# EAGLE design sb3 (EAGLE 9.4.0)
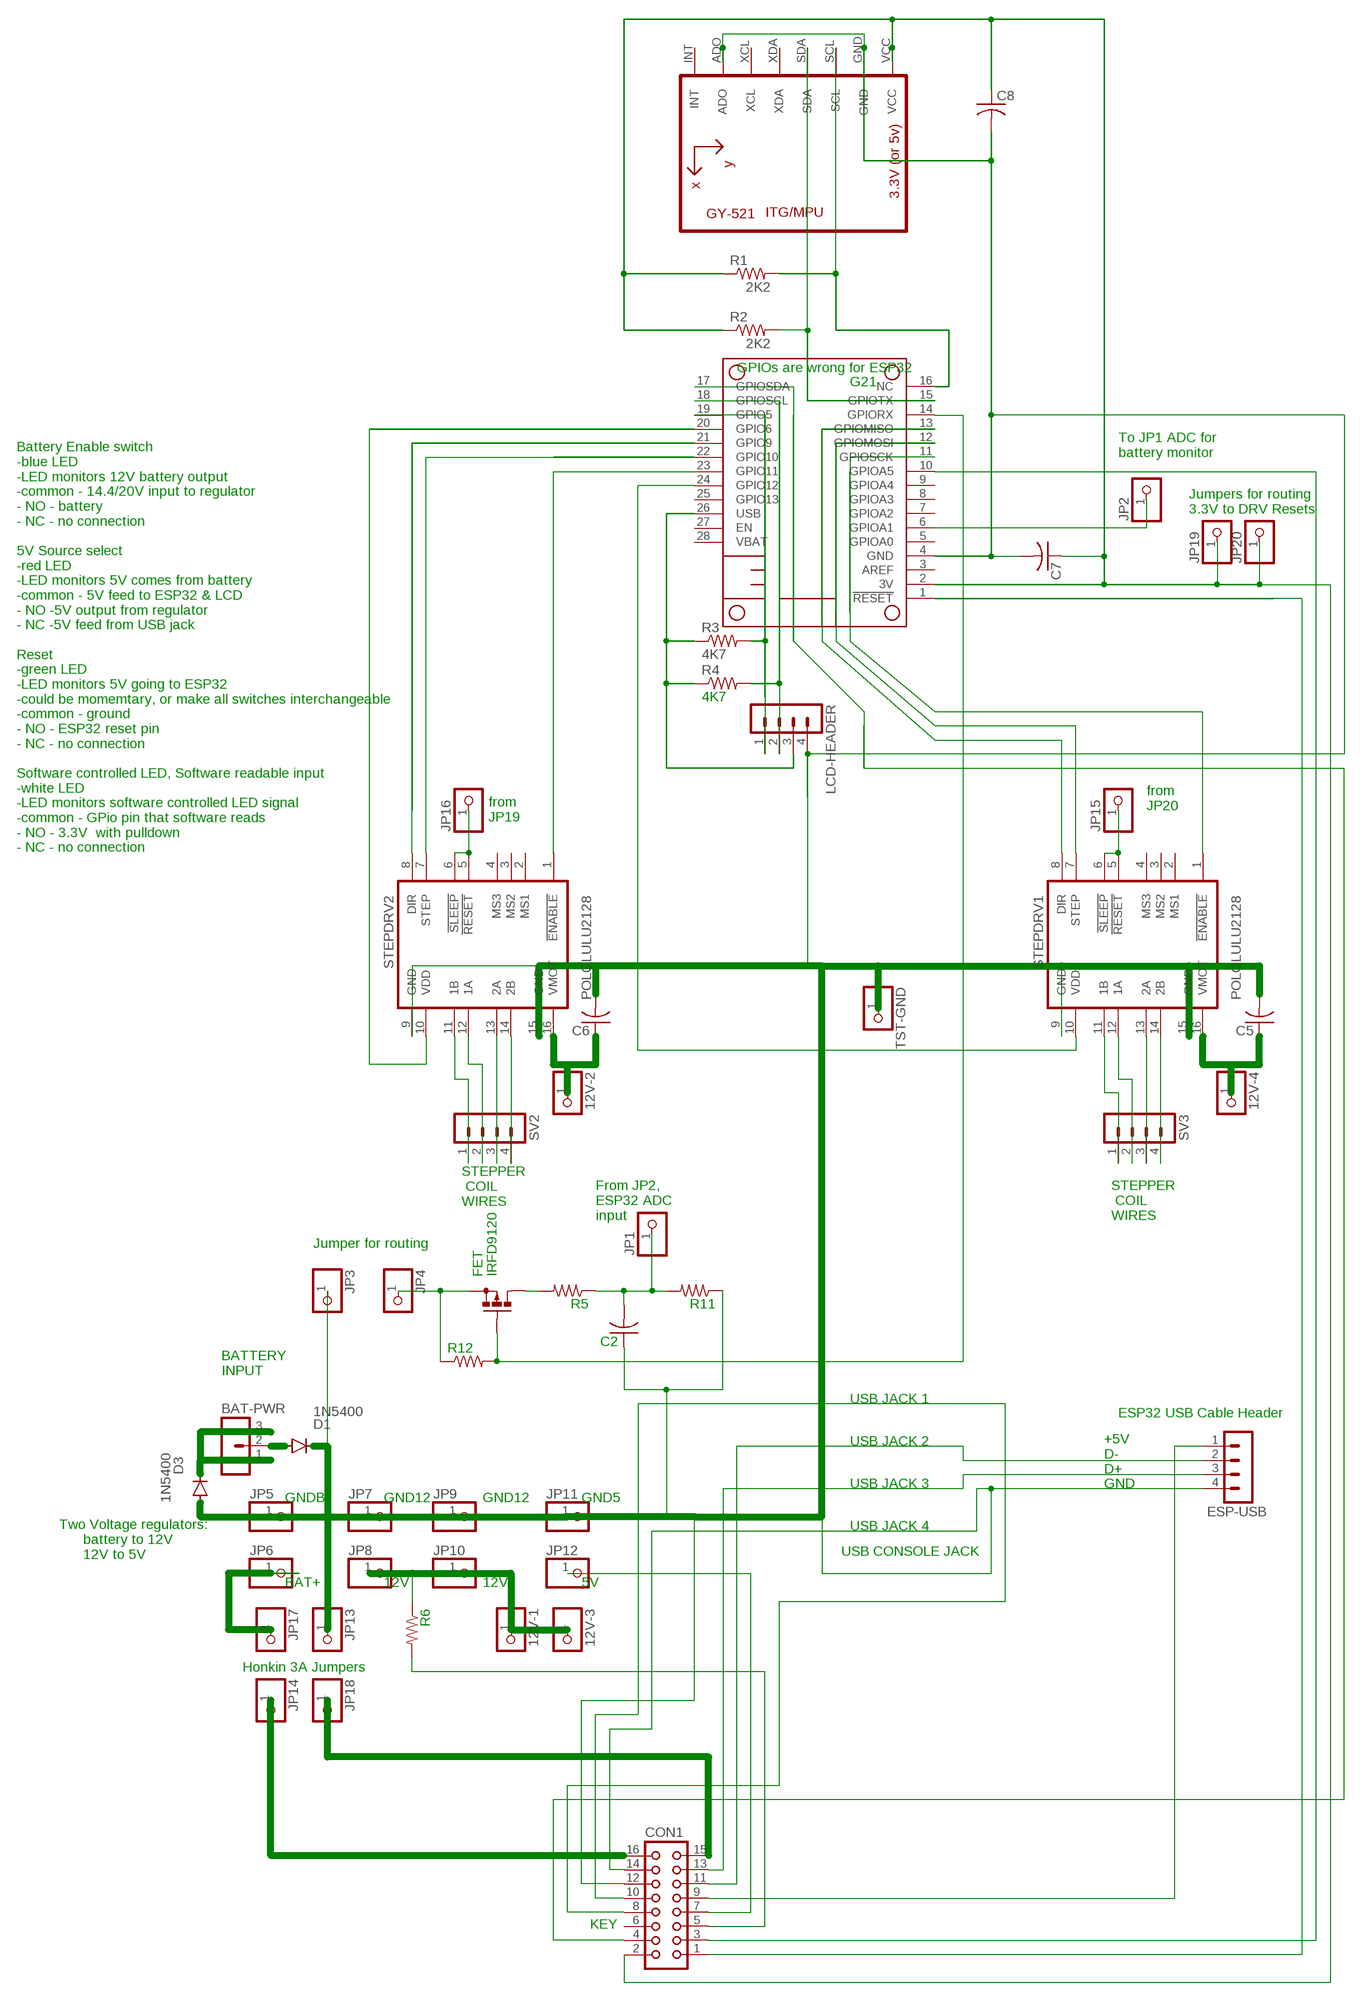
[diagram p0: schematic, sheet 1]

## Parts
12V-1  PINHD-1X1  [1X01]
12V-2  PINHD-1X1  [1X01]
12V-3  PINHD-1X1  [1X01]
12V-4  PINHD-1X1  [1X01]
BAT-PWR  MA03-1  [MA03-1]
C2  C-US050-025X075  [C050-025X075]
C5  C-US050-024X044  [C050-024X044]
C6  C-US050-024X044  [C050-024X044]
C7  C-US050-024X044  [C050-024X044]
C8  C-US050-024X044  [C050-024X044]
CON1  CON16  [CON16]
D1  1N5400  [DO201-15]
D3  1N5400  [DO201-15]
ESP-USB  MA04-1  [MA04-1]
FET  IRFD9120  [C370-01]
JP1  PINHD-1X1  [1X01]
JP2  PINHD-1X1  [1X01]
JP3  PINHD-1X1  [1X01]
JP4  PINHD-1X1  [1X01]
JP5  PINHD-1X1  [1X01]
JP6  PINHD-1X1  [1X01]
JP7  PINHD-1X1  [1X01]
JP8  PINHD-1X1  [1X01]
JP9  PINHD-1X1  [1X01]
JP10  PINHD-1X1  [1X01]
JP11  PINHD-1X1  [1X01]
JP12  PINHD-1X1  [1X01]
JP13  PINHD-1X1  [1X01]
JP14  PINHD-1X1  [1X01]
JP15  PINHD-1X1  [1X01]
JP16  PINHD-1X1  [1X01]
JP17  PINHD-1X1  [1X01]
JP18  PINHD-1X1  [1X01]
JP19  PINHD-1X1  [1X01]
JP20  PINHD-1X1  [1X01]
LCD-HEADER  MA04-1  [MA04-1]
MS2  FEATHERWING_NOHOLES  [FEATHERWING_NOHOLES]
R1  2K2  R-US_0309/12  [0309/12]
R2  2K2  R-US_0309/12  [0309/12]
R3  4K7  R-US_0309/12  [0309/12]
R4  4K7  R-US_0309/12  [0309/12]
R5  R-US_0207/10  [0207/10]
R6  R-US_0207/10  [0207/10]
R11  R-US_0207/10  [0207/10]
R12  R-US_0207/10  [0207/10]
STEPDRV1  POLOLULU2128  [POLOLULU2128]
STEPDRV2  POLOLULU2128  [POLOLULU2128]
SV2  MA04-1  [MA04-1]
SV3  MA04-1  [MA04-1]
TST-GND  PINHD-1X1  [1X01]
U1  GY-521MPU6050  [GY-521]

## Nets
3V: C7.1 C8.1 CON1.2 JP19.1 JP20.1 MS2.2(3V) R1.1 R2.1 U1.VCC
N$1: MS2.24(GPIO12) STEPDRV1.10(VDD)
N$2: CON1.5 R6.2
N$3: MS2.13(GPIOMISO) STEPDRV1.8(DIR)
N$4: CON1.1 MS2.1(!RESET)
N$5: JP15.1 STEPDRV1.5(!RESET) STEPDRV1.6(!SLEEP)
N$6: FET.G MS2.14(GPIORX) R12.2
N$7: JP16.1 STEPDRV2.5(!RESET) STEPDRV2.6(!SLEEP)
N$8: STEPDRV2.14(2B) SV2.4
N$9: CON1.16 JP14.1
N$11: LCD-HEADER.1 MS2.19(GPIO5) R3.2
N$12: STEPDRV2.13(2A) SV2.3
N$13: STEPDRV2.12(1A) SV2.2
N$14: STEPDRV2.11(1B) SV2.1
N$15: MS2.12(GPIOMOSI) STEPDRV1.7(STEP)
N$16: STEPDRV1.14(2B) SV3.4
N$17: MS2.16(NC) R1.2 U1.SCL
N$18: STEPDRV1.13(2A) SV3.3
N$19: STEPDRV1.12(1A) SV3.2
N$20: STEPDRV1.11(1B) SV3.1
N$21: MS2.11(GPIOSCK) STEPDRV1.1(!ENABLE)
N$22: CON1.11 ESP-USB.2
N$23: CON1.13 ESP-USB.3
N$24: FET.S JP4.1 R12.1
N$25: MS2.15(GPIOTX) R2.2 U1.SDA
N$26: BAT-PWR.2 D1.A
N$27: JP6.1 JP17.1
N$28: CON1.4 MS2.17(GPIOSDA)
N$29: MS2.21(GPIO9) STEPDRV2.8(DIR)
N$30: C2.2 JP1.1 R5.1 R11.2
N$31: CON1.3 MS2.10(GPIOA5)
N$32: D1.C JP3.1 JP13.1
N$33: JP2.1 MS2.6(GPIOA1)
N$34: MS2.22(GPIO10) STEPDRV2.7(STEP)
N$35: LCD-HEADER.2 MS2.18(GPIOSCL) R4.2
N$36: MS2.20(GPIO6) STEPDRV2.10(VDD)
N$37: MS2.23(GPIO11) STEPDRV2.1(!ENABLE)
N$38: CON1.15 JP18.1
N$39: C2.1 C5.2 C6.2 C7.2 C8.2 CON1.12 CON1.14 D3.A ESP-USB.4 JP5.1 JP7.1 JP9.1 JP11.1 LCD-HEADER.4 MS2.4(GND) R11.1 STEPDRV1.9(GND) STEPDRV1.15(GND) STEPDRV2.9(GND) STEPDRV2.15(GND) TST-GND.1 U1.ADO U1.GND
N$40: CON1.8 CON1.10
N$42: 12V-1.1 12V-3.1 JP8.1 JP10.1 R6.1
N$43: CON1.7 JP12.1
N$44: 12V-2.1 C6.1 STEPDRV2.16(VMOT)
N$45: 12V-4.1 C5.1 STEPDRV1.16(VMOT)
N$46: BAT-PWR.1 BAT-PWR.3 D3.C
N$51: FET.D FET.D1(D) R5.2
N$55: CON1.9 ESP-USB.1
USB: LCD-HEADER.3 MS2.26(USB) R3.1 R4.1
Unconnected: CON1.6 MS2.3(AREF) MS2.5(GPIOA0) MS2.7(GPIOA2) MS2.8(GPIOA3) MS2.9(GPIOA4) MS2.25(GPIO13) MS2.27(EN) MS2.28(VBAT) STEPDRV1.2(MS1) STEPDRV1.3(MS2) STEPDRV1.4(MS3) STEPDRV2.2(MS1) STEPDRV2.3(MS2) STEPDRV2.4(MS3) U1.INT U1.XCL U1.XDA

## Notes on the sheet
- GPIOs are wrong for ESP32
- G21
- To JP1 ADC for
  battery monitor
- Jumpers for routing
  3.3V to DRV Resets
- from
  JP20
- from
  JP19
- Battery Enable switch
  -blue LED
  -LED monitors 12V battery output
  -common - 14.4/20V input to regulator
  - NO - battery
  - NC - no connection
  
  5V Source select
  -red LED
  -LED monitors 5V comes from battery
  -common - 5V feed to ESP32 & LCD
  - NO -5V output from regulator
  - NC -5V feed from USB jack
  
  Reset
  -green LED
  -LED monitors 5V going to ESP32
  -could be momemtary, or make all switches interchangeable
  -common - ground
  - NO - ESP32 reset pin
  - NC - no connection
  
  Software controlled LED, Software readable input
  -white LED
  -LED monitors software controlled LED signal 
  -common - GPio pin that software reads
  - NO - 3.3V  with pulldown
  - NC - no connection
- STEPPER
   COIL
  WIRES
- From JP2,
  ESP32 ADC
  input
- STEPPER
   COIL
  WIRES
- Jumper for routing
- BATTERY
  INPUT
- USB JACK 1
- ESP32 USB Cable Header
- USB JACK 2
- USB JACK 3
- +5V
  D-
  D+
  GND
- GNDB | GND12 | GND12 | GND5
- USB JACK 4
- USB CONSOLE JACK
- Two Voltage regulators:
        battery to 12V
        12V to 5V
- BAT+ | 12V | 12V | 5V
- Honkin 3A Jumpers
- KEY

## Library data of the parts
12V-1-12V-4 JP1-JP20 TST-GND = pinhead:PINHD-1X1: PIN HEADER
BAT-PWR = con-lstb:MA03-1: PIN HEADER; OC_FARNELL: unknown; OC_NEWARK: unknown
C2 C5-C8 = rcl:C-US: CAPACITOR, American symbol; SPICEPREFIX: C
CON1 = con-harting:CON16: CONNECTOR; OC_FARNELL: unknown; OC_NEWARK: unknown
D1 D3 = diode:1N5400: DIODE standard rectifier, 3 A, 50 V (Motorola)
ESP-USB LCD-HEADER SV2 SV3 = con-lstb:MA04-1: PIN HEADER; OC_FARNELL: unknown; OC_NEWARK: unknown
FET = transistor-small-signal:IRFD9120: P-CHANNEL MOS FET
MS2 = microbuilder:FEATHERWING
R1-R4 = resistor:R-US_: RESISTOR, American symbol
R5 R6 R11 R12 = rcl:R-US_: RESISTOR, American symbol; SPICEPREFIX: R
STEPDRV1 STEPDRV2 = stepper_drivers_etc:POLOLULU2128
U1 = gy-521a:GY-521

## Board
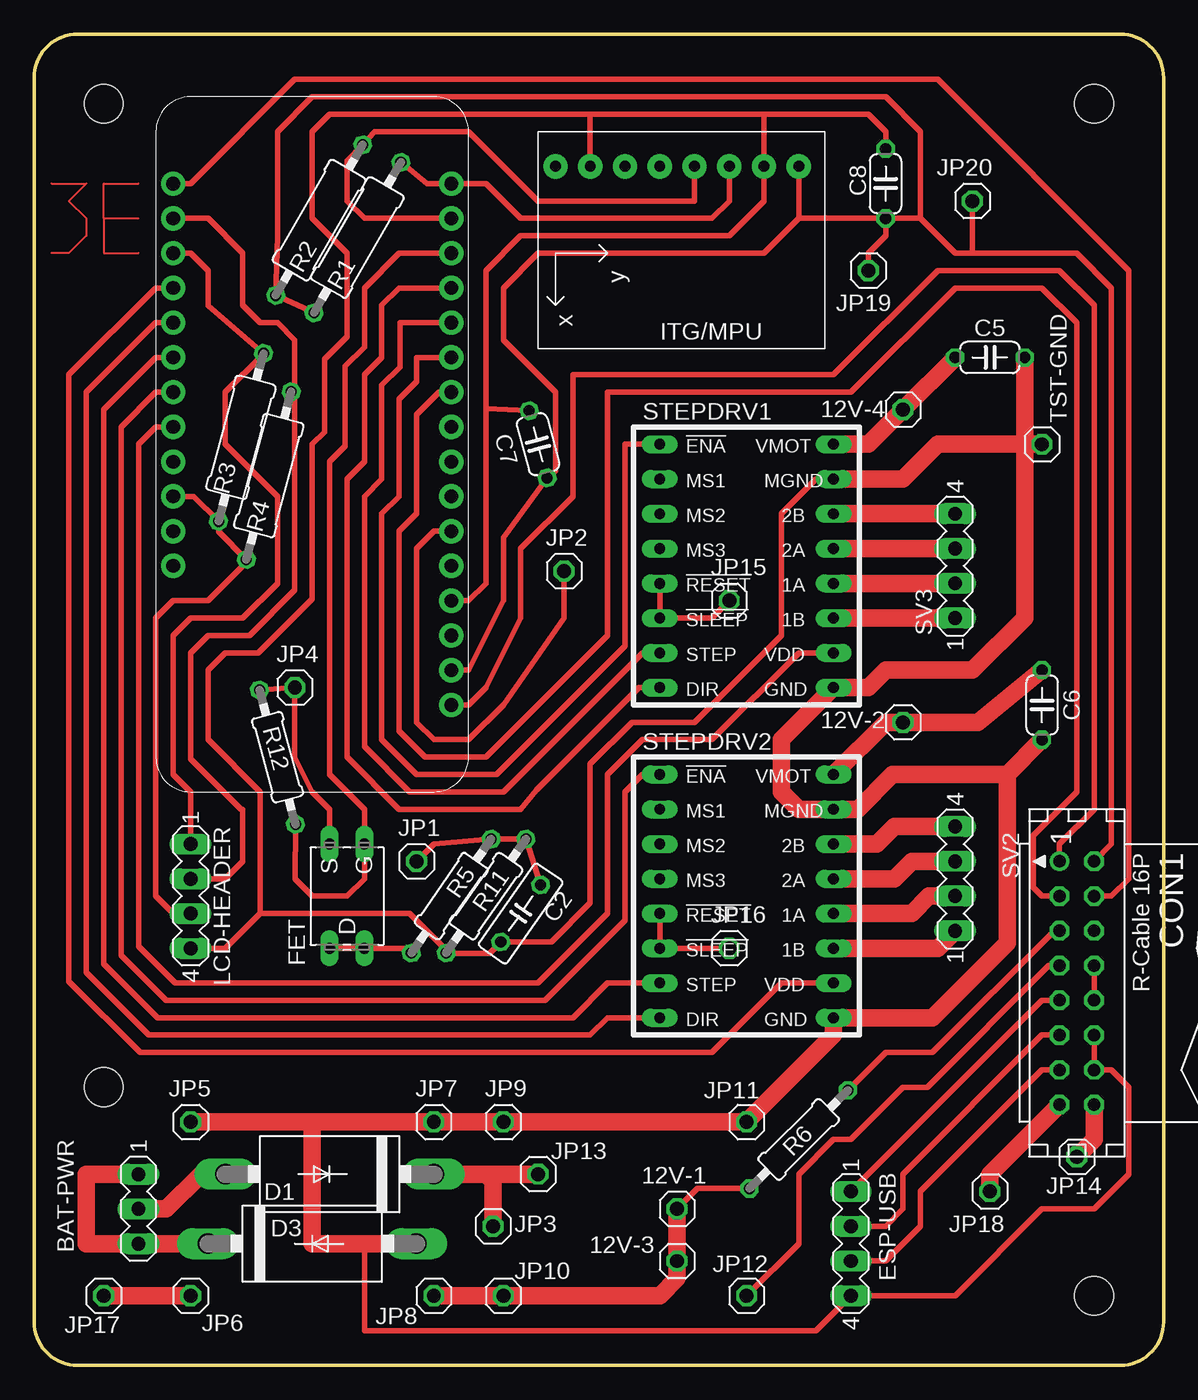
[diagram p1: board, top side]

Size 82.55 x 97.28 mm. Coordinates in mm from the lower left corner, seen from the top.
Outline: 82.55,94.11 arc90 79.38,97.28 3.17,97.28 arc90 0,94.11 0,3.17 arc90 3.17,0 79.38,0 arc90 82.55,3.17 82.55,94.11
Copper layers (1*16): Top 0.035mm / dielectric 1.5mm / Bottom 0.035mm
Design rules "default": minimum track width 6mil, minimum drill 0.35mm, track to track 6mil, track to pad 6mil, pad to pad 6mil, via to via 6mil, smd to smd 6mil, copper to edge 40mil, drill to drill 6mil, minimum pad ring 10mil, minimum via ring 8mil, stop-mask expansion 4mil, vias tented up to drill 0mil, thermal gap 10mil
Holes 2.85 mm at 77.47,92.2 5.08,20.32 5.08,92.2 77.47,5.08

### Footprints (pad centres in the part's own frame; a part is rotated, then mirrored left to right if it is on the bottom)
1X01 = drill 1.016 octagon: 1 0,0
MA03-1 = drill 1.016 long: 1 -2.54,0; 2 0,0; 3 2.54,0
C050-025X075 = drill 0.813 octagon: 1 -2.54,0; 2 2.54,0
C050-024X044 = drill 0.813 octagon: 1 -2.54,0; 2 2.54,0
CON16 = drill 0.914: 1 -8.89,-1.27 | drill 0.914 octagon: 2 -8.89,1.27; 3 -6.35,-1.27; 4 -6.35,1.27; 5 -3.81,-1.27; 6 -3.81,1.27; 7 -1.27,-1.27; 8 -1.27,1.27; 9 1.27,-1.27; 10 1.27,1.27; 11 3.81,-1.27; 12 3.81,1.27; 13 6.35,-1.27; 14 6.35,1.27; 15 8.89,-1.27; 16 8.89,1.27
DO201-15 = drill 1.499 long: A 7.62,0; C -7.62,0
MA04-1 = drill 1.016 long: 1 -3.81,0; 2 -1.27,0; 3 1.27,0; 4 3.81,0
C370-01 = drill 0.813 long: D -3.81,1.27; D1 -3.81,-1.27; G 3.81,-1.27; S 3.81,1.27
FEATHERWING_NOHOLES = drill 1 pad 1.778: 1 6.35,1.27; 2 8.89,1.27; 3 11.43,1.27; 4 13.97,1.27; 5 16.51,1.27; 6 19.05,1.27; 7 21.59,1.27; 8 24.13,1.27; 9 26.67,1.27; 10 29.21,1.27; 11 31.75,1.27; 12 34.29,1.27; 13 36.83,1.27; 14 39.37,1.27; 15 41.91,1.27; 16 44.45,1.27; 17 44.45,21.59; 18 41.91,21.59; 19 39.37,21.59; 20 36.83,21.59; 21 34.29,21.59; 22 31.75,21.59; 23 29.21,21.59; 24 26.67,21.59; 25 24.13,21.59; 26 21.59,21.59; 27 19.05,21.59; 28 16.51,21.59
0309/12 = drill 0.813 octagon: 1 -6.35,0; 2 6.35,0
0207/10 = drill 0.813 octagon: 1 -5.08,0; 2 5.08,0
POLOLULU2128 = drill 0.8 long: 1 -7.62,7.62; 2 -7.62,5.08; 3 -7.62,2.54; 4 -7.62,0; 5 -7.62,-2.54; 6 -7.62,-5.08; 7 -7.62,-7.62; 8 -7.62,-10.16; 9 5.08,-10.16; 10 5.08,-7.62; 11 5.08,-5.08; 12 5.08,-2.54; 13 5.08,0; 14 5.08,2.54; 15 5.08,5.08; 16 5.08,7.62
GY-521 = drill 0.8 pad 1.778: ADO -8.89,-6.35; GND -8.89,6.35; INT -8.89,-8.89; SCL -8.89,3.81; SDA -8.89,1.27; VCC -8.89,8.89; XCL -8.89,-3.81; XDA -8.89,-1.27

### Placement (x,y rotation side)
12V-1  46.99,11.43 0 top
12V-2  63.5,46.99 0 top
12V-3  46.99,7.62 0 top
12V-4  63.5,69.85 0 top
BAT-PWR  7.62,11.43 270 top
C2  35.56,33.02 55 top
C5  69.85,73.66 0 top
C6  73.66,48.26 270 top
C7  36.83,67.31 105 top
C8  62.23,86.36 90 top
CON1  76.2,27.94 270 top
D1  21.59,13.97 180 top
D3  20.32,8.89 0 top
ESP-USB  59.69,8.89 270 top
FET  22.86,34.29 90 top
JP1  27.94,36.83 0 top
JP2  38.73,58.04 0 top
JP3  33.53,10.16 0 top
JP4  19.05,49.53 0 top
JP5  11.43,17.78 0 top
JP6  11.43,5.08 0 top
JP7  29.21,17.78 0 top
JP8  29.21,5.08 0 top
JP9  34.29,17.78 0 top
JP10  34.29,5.08 0 top
JP11  52.07,17.78 0 top
JP12  52.07,5.08 0 top
JP13  36.83,13.97 0 top
JP14  76.2,15.24 0 top
JP15  50.8,55.88 0 top
JP16  50.8,30.48 0 top
JP17  5.08,5.08 0 top
JP18  69.85,12.7 0 top
JP19  60.96,80.01 0 top
JP20  68.58,85.09 0 top
LCD-HEADER  11.43,34.29 270 top
MS2  31.75,41.91 90 top
R1  23.62,82.42 60 top
R2  20.83,83.69 60 top
R3  15.11,67.82 75 top
R4  17.14,65.02 75 top
R5  30.48,34.29 235 top
R6  55.88,16.51 45 top
R11  33.02,34.29 55 top
R12  17.78,44.45 285 top
STEPDRV1  53.34,59.69 0 top
STEPDRV2  53.34,35.56 0 top
SV2  67.31,35.56 90 top
SV3  67.31,58.42 90 top
TST-GND  73.66,67.31 0 top
U1  46.99,78.74 270 top

### Tracks (layer width: path | path; a pad name or v marks a point on that pad's centre or on a via)
3V
  Top 0.406: 55.88,83.82 C8.1 | C8.1 64.77,83.82 | 64.77,83.82 64.77,90.17 62.23,92.71 20.32,92.71 17.78,90.17 17.78,82.55 17.64,78.12 R2.1 R1.1 | 55.88,83.82 53.34,81.28 36.83,81.28 34.29,78.74 34.29,74.93 38.1,71.12 38.1,65.35 C7.1 34.29,60.5 34.29,55.88 31.75,50.8 MS2.2 | C8.1 62.23,82.55 60.96,81.28 JP19.1 | JP20.1 68.58,81.28 | 68.58,81.28 67.31,81.28 64.77,83.82 | 68.58,81.28 76.2,81.28 78.74,78.74 78.74,38.1 CON1.2 | U1.VCC 55.88,83.82
N$1
  Top 0.406: MS2.24 8.89,68.58 7.62,67.31 7.62,30.61 10.29,27.94 36.83,27.94 41.91,33.02 41.91,43.18 44.45,45.72 49.53,45.72 55.88,52.07 STEPDRV1.10
N$2
  Top 0.406: R6.2 62.23,22.86 65.66,22.86 74.55,31.75 CON1.5
N$3
  Top 0.406: STEPDRV1.8 44.2,49.53 36.7,42.04 35.56,40.64 26.67,40.64 22.86,44.45 22.86,64.77 24.13,66.04 24.13,72.39 25.4,73.66 25.4,77.47 26.67,78.74 MS2.13
N$4
  Top 0.406: MS2.1 31.75,48.26 33.02,49.53 35.56,54.61 35.56,59.69 39.37,63.5 39.37,72.39 58.42,72.39 66.04,80.01 74.93,80.01 77.47,77.47 77.47,40.64 74.93,38.1 CON1.1
N$5
  Top 0.406: STEPDRV1.5 STEPDRV1.6 49.53,54.61 JP15.1
N$6
  Top 0.406: MS2.14 26.67,81.28 24.13,78.74 24.13,74.42 22.73,73.03 22.73,67.18 21.59,66.04 21.59,43.18 24.13,40.64 FET.G 24.13,35.56 22.86,34.29 20.32,34.29 19.06,35.55 19.06,35.56 R12.2
N$7
  Top 0.406: STEPDRV2.5 STEPDRV2.6 JP16.1
N$8
  Top 1.27: SV2.4 62.87,39.37 61.59,38.1 STEPDRV2.14
N$9
  Top 1.27: JP14.1 77.47,16.51 CON1.16
N$10
  Top 0.152: 1.27,86.36 3.81,86.36 2.54,85.09 3.81,83.82 3.81,82.55 2.54,81.28 1.27,81.28
N$11
  Top 0.406: MS2.19 11.43,81.28 12.7,80.01 12.7,77.46 R3.2 16.76,73.91 13.97,71.12 13.97,67.31 17.78,63.5 17.78,57.15 15.24,54.61 11.43,54.61 10.16,53.34 10.16,43.18 11.43,41.91 LCD-HEADER.1
N$12
  Top 1.27: SV2.3 64.14,36.83 62.87,35.56 STEPDRV2.13
N$13
  Top 1.27: SV2.2 65.41,34.29 64.14,33.02 STEPDRV2.12
N$14
  Top 1.27: SV2.1 66.04,30.48 STEPDRV2.11
N$15
  Top 0.406: STEPDRV1.7 44.45,52.07 34.29,41.91 27.43,41.91 24.13,45.21 24.13,63.5 25.4,64.77 25.4,71.63 26.73,72.96 26.73,76.2 MS2.12
N$16
  Top 1.27: STEPDRV1.14 SV3.4
N$17
  Top 0.406: R1.2 28.7,86.36 MS2.16 33.02,86.36 35.56,83.82 49.53,83.82 50.8,85.09 U1.SCL
N$18
  Top 1.27: STEPDRV1.13 SV3.3
N$19
  Top 1.27: STEPDRV1.12 SV3.2
N$20
  Top 1.27: STEPDRV1.11 SV3.1
N$21
  Top 0.406: STEPDRV1.1 43.18,67.31 43.18,52.58 33.78,43.18 27.94,43.18 25.4,45.72 25.4,62.23 26.67,63.5 26.67,70.61 27.94,71.88 27.94,73.66 MS2.11
N$22
  Top 0.406: ESP-USB.2 62.23,10.16 63.5,11.43 63.5,13.97 73.66,24.13 CON1.11
N$23
  Top 0.406: ESP-USB.3 62.23,7.62 64.77,10.16 64.77,12.7 73.66,21.59 CON1.13
N$24
  Top 0.406: R12.1 JP4.1 19.05,44.45 20.32,41.91 21.59,40.64 FET.S
N$25
  Top 0.406: MS2.15 24.13,83.82 22.86,85.09 22.86,88.05 R2.2 24.88,90.17 31.75,90.17 36.83,85.09 48.26,85.09 U1.SDA
N$26
  Top 1.27: BAT-PWR.2 9.65,11.43 12.19,13.97 D1.A
N$27
  Top 1.27: JP6.1 JP17.1
N$28
  Top 0.406: MS2.17 11.43,86.36 19.05,93.98 66.04,93.98 80.01,80.01 80.01,35.56 78.74,34.29 CON1.4
N$29
  Top 0.406: MS2.21 8.89,76.2 3.81,71.12 3.81,28.7 8.38,24.13 40.64,24.13 41.91,25.4 STEPDRV2.8
N$30
  Top 0.406: C2.2 R11.2 R5.1 29.21,38.1 JP1.1
N$31
  Top 0.406: CON1.3 73.66,34.29 73.03,34.92 73.03,38.73 76.2,41.91 76.2,76.2 73.66,78.74 67.31,78.74 59.69,71.12 41.91,71.12 41.91,53.34 33.02,44.45 28.57,44.45 26.67,46.35 26.67,60.96 27.94,62.23 27.94,69.47 29.59,71.12 MS2.10
N$32
  Top 1.27: D1.C 33.02,13.97 | 33.02,13.97 JP13.1 | JP3.1 33.53,13.46 33.02,13.97
N$33
  Top 0.406: JP2.1 38.73,54.61 34.29,48.26 31.75,45.72 29.21,45.72 27.94,46.99 27.94,59.69 29.21,60.96 MS2.6
N$34
  Top 0.406: MS2.22 8.89,73.66 5.08,69.85 5.08,29.34 9.02,25.4 39.37,25.4 41.91,27.94 STEPDRV2.7
N$35
  Top 0.406: MS2.18 12.7,83.82 15.24,81.28 15.24,77.47 16.51,76.2 17.78,76.2 19.05,74.93 19.05,71.12 | LCD-HEADER.2 13.97,35.56 15.24,36.83 15.24,40.64 15.11,40.64 11.43,44.32 11.43,52.07 12.7,53.34 15.75,53.34 19.05,56.64 19.05,71.12 | 19.05,71.12 19.01,71.16 R4.2
N$36
  Top 0.406: MS2.20 8.89,78.74 2.54,72.39 2.54,28.07 7.75,22.86 49.53,22.86 54.61,27.94 STEPDRV2.10
N$37
  Top 0.406: MS2.23 8.89,71.12 6.35,68.58 6.35,29.97 9.65,26.67 37.34,26.67 43.18,32.51 43.18,41.91 44.45,43.18 STEPDRV2.1
N$38
  Top 1.27: JP18.1 69.85,13.97 CON1.15
N$39
  Top 0.152: R11.1 30.14,30.1
  Top 0.406: 30.14,30.1 33.26,30.1 C2.1 37.8,30.94 40.64,33.78 40.64,43.94 43.69,46.99 48.26,46.99 54.61,53.34 54.61,62.23 57.15,64.77 STEPDRV1.15 | C8.2 62.23,90.17 60.96,91.44 53.34,91.44 | 33.02,69.91 33.02,80.01 35.56,82.55 50.8,82.55 53.34,85.09 U1.GND 53.34,91.44 | 53.34,91.44 40.64,91.44 | 40.64,91.44 21.59,91.44 20.32,90.17 20.32,83.82 22.86,81.28 22.86,75.18 21.21,73.53 21.21,68.2 20.32,67.31 20.32,56.01 16.38,52.07 13.97,52.07 12.7,50.8 12.7,45.72 16.51,41.91 16.51,33.02 | 33.02,69.91 C7.2 | 24.13,8.89 24.13,2.54 57.15,2.54 ESP-USB.4 67.31,5.08 73.66,11.43 77.47,11.43 80.01,13.97 80.01,20.32 78.74,21.59 CON1.14 CON1.12 | MS2.4 31.75,55.88 33.02,57.15 33.02,69.91 | LCD-HEADER.4 13.97,30.48 16.51,33.02 | 16.51,33.02 27.43,33.02 30.11,30.35 R11.1 | U1.ADO 40.64,91.44
  Top 1.27: 72.39,67.31 72.39,54.61 68.58,50.8 62.23,50.8 60.96,49.53 STEPDRV1.9 54.61,45.72 54.61,41.91 55.88,40.64 STEPDRV2.15 60.2,40.64 62.74,43.18 71.12,43.18 | STEPDRV1.15 63.5,64.77 66.04,67.31 72.39,67.31 | 20.32,17.78 20.32,8.89 24.13,8.89 D3.A | 72.39,67.31 TST-GND.1 | 71.12,43.18 71.12,30.86 65.66,25.4 STEPDRV2.9 58.42,24.13 JP11.1 JP9.1 JP7.1 20.32,17.78 | 71.12,43.18 C6.2 | C5.2 72.39,67.31 | JP5.1 20.32,17.78
N$40
  Top 0.406: CON1.10 CON1.8
N$41
  Top 0.152: 5.08,83.82 5.08,81.28 7.62,81.28 | 5.08,83.82 5.08,86.36 7.62,86.36 | 5.08,83.82 7.62,83.82
N$42
  Top 0.406: 12V-1.1 48.48,12.92 R6.1
  Top 1.27: JP8.1 JP10.1 45.72,5.08 46.99,6.35 12V-3.1 12V-1.1
N$43
  Top 0.406: JP12.1 55.88,8.89 55.88,13.97 58.42,16.51 59.69,16.51 63.5,20.32 65.28,20.32 74.17,29.21 CON1.7
N$44
  Top 1.27: C6.1 68.97,46.99 12V-2.1 62.23,46.99 STEPDRV2.16
N$45
  Top 1.27: STEPDRV1.16 60.96,67.31 12V-4.1 C5.1
N$46
  Top 1.27: BAT-PWR.1 3.81,13.97 3.81,8.89 BAT-PWR.3 D3.C
N$51
  Top 0.406: FET.D FET.D1 27.65,30.48 R5.2
N$55
  Top 0.406: ESP-USB.1 73.66,26.67 CON1.9
USB
  Top 0.406: LCD-HEADER.3 10.16,33.02 8.89,34.29 8.89,54.61 10.16,55.88 12.7,55.88 15.5,58.68 R4.1 13.47,60.92 R3.1 11.65,63.5 MS2.26
(copper drawn outside any net)
  shapes: Top area x2